# Altium schematic sheet Power.SchDoc
size B; DocumentNumber: 6; SheetNumber: 6; SheetTotal: 9; ENG_APP_DATE: --/--/--; DSN_APP_DATE: --/--/--; CHK_APP_DATE: --/--/--
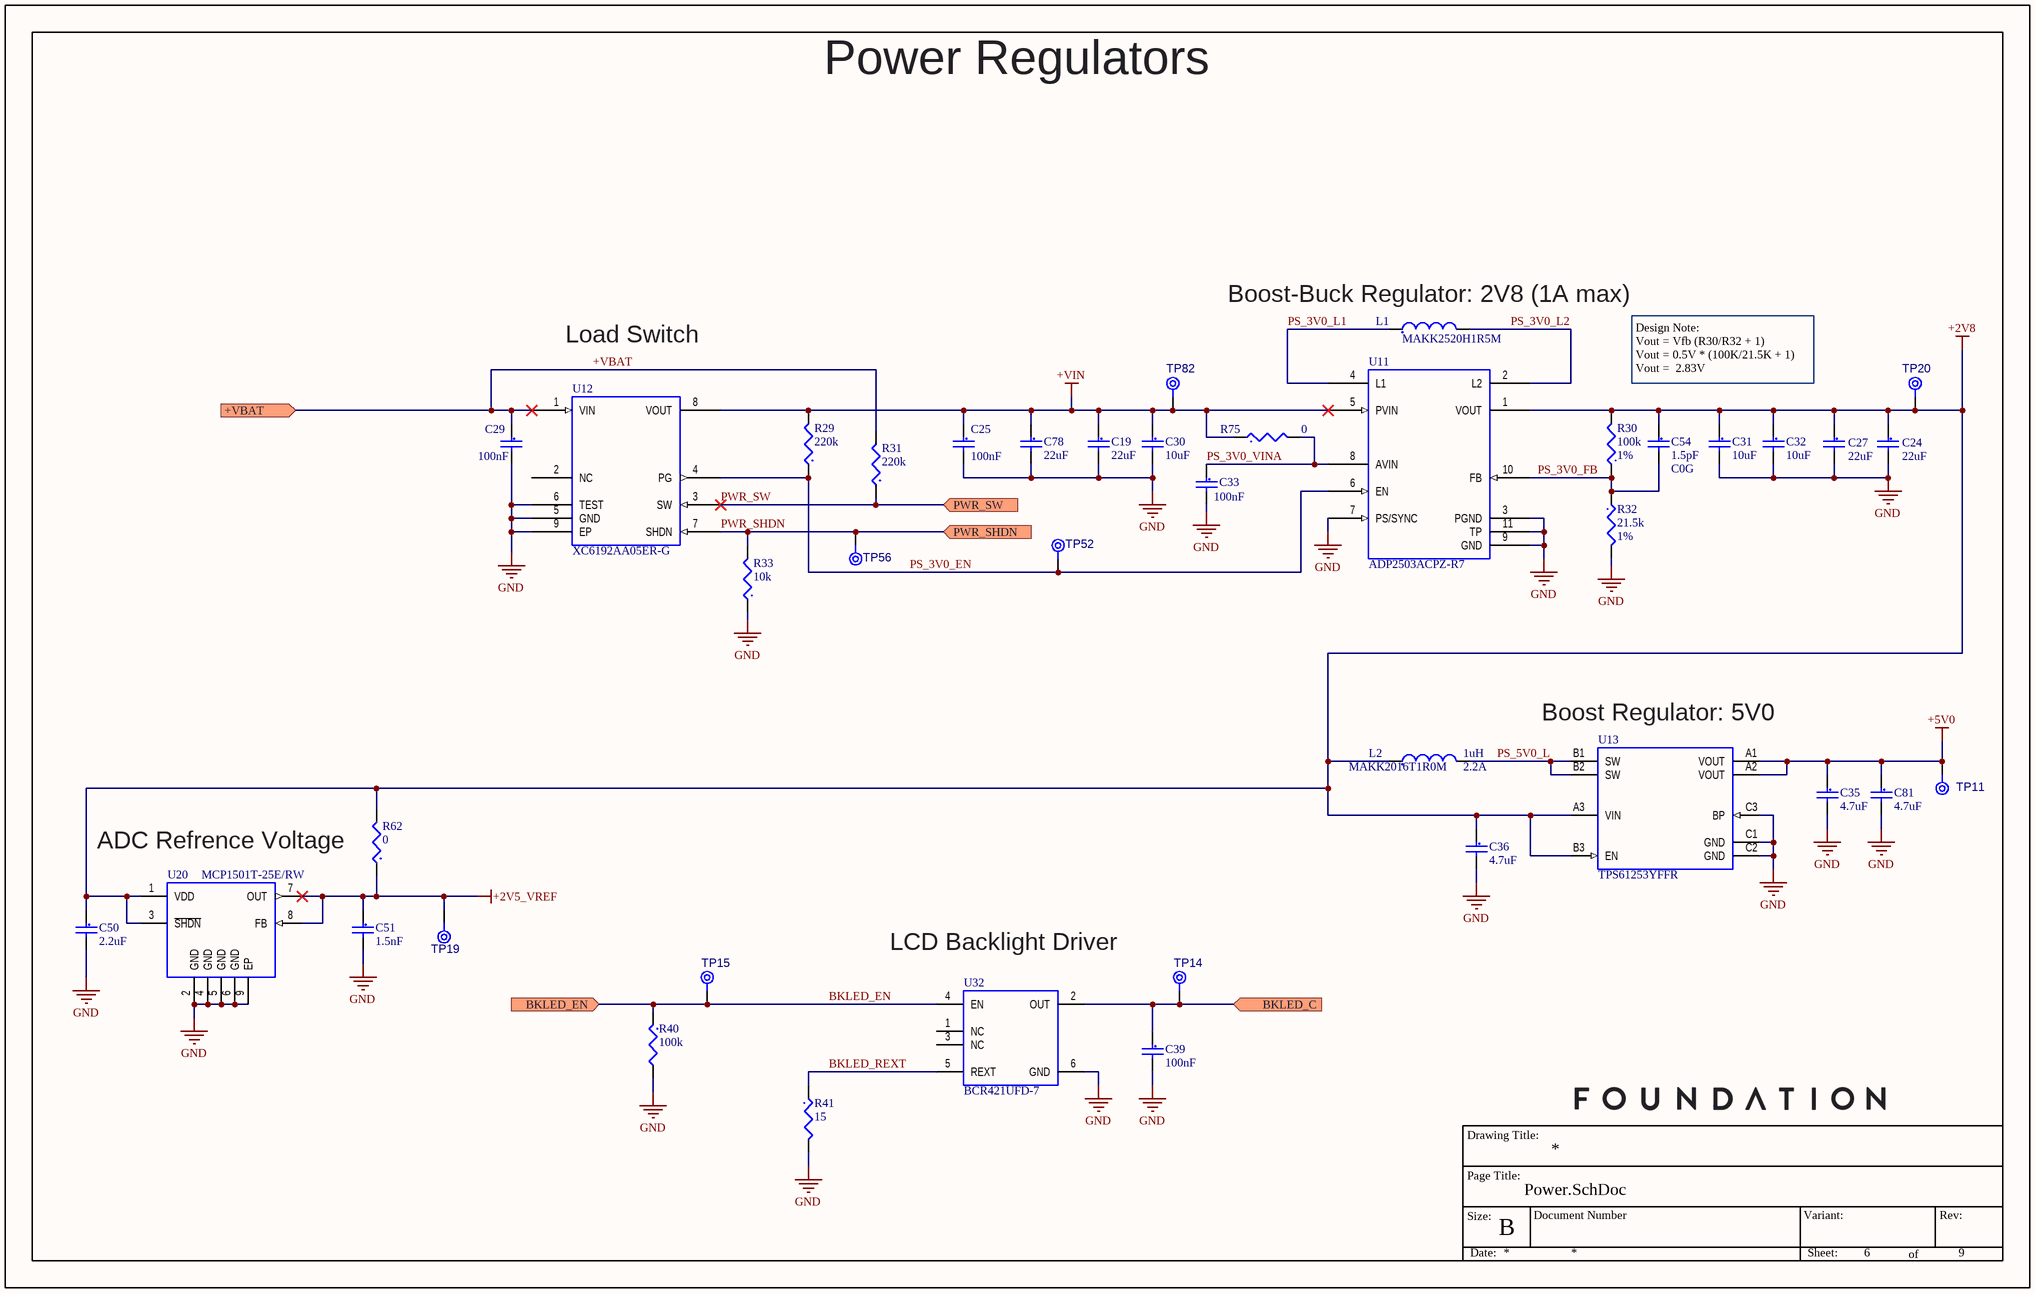
[diagram p0: Power.SchDoc]

## Parts
C19  Capacitance: 22uF  [CAPC0603(1608)90_L]  (hidden comment: CAP CER 22uF 6.3V 20% X5R 0603)
C24  Capacitance: 22uF  [CAPC0603(1608)90_L]  (hidden comment: CAP CER 22uF 6.3V 20% X5R 0603)
C25  Capacitance: 100nF  [CAPC0402(1005)55_L]  (hidden comment: CAP CER 0.1uF 16V 10% X7R 0402)
C27  Capacitance: 22uF  [CAPC0603(1608)90_L]  (hidden comment: CAP CER 22uF 6.3V 20% X5R 0603)
C29  Capacitance: 100nF  [CAPC0402(1005)55_L]  (hidden comment: CAP CER 0.1uF 16V 10% X7R 0402)
C30  Capacitance: 10uF  [CAPC0603(1608)90_L]  (hidden comment: CAP CER 10uF 6.3V 20% X5R 0603)
C31  Capacitance: 10uF  [CAPC0603(1608)90_L]  (hidden comment: CAP CER 10uF 6.3V 20% X5R 0603)
C32  Capacitance: 10uF  [CAPC0603(1608)90_L]  (hidden comment: CAP CER 10uF 6.3V 20% X5R 0603)
C33  Capacitance: 100nF  [CAPC0402(1005)55_L]  (hidden comment: CAP CER 0.1uF 16V 10% X7R 0402)
C35  Capacitance: 4.7uF  [CAPC0402(1005)55_L]  (hidden comment: CAP CER 4.7UF 10V 20% X5R 0402)
C36  Capacitance: 4.7uF  [CAPC0402(1005)55_L]  (hidden comment: CAP CER 4.7UF 10V 20% X5R 0402)
C39  Capacitance: 100nF  [CAPC0402(1005)55_L]  (hidden comment: CAP CER 0.1uF 16V 10% X7R 0402)
C50  Capacitance: 2.2uF  [CAPC0402(1005)55_L]  (hidden comment: CAP CER 2.2uF 6.3V 10% X5R 0402)
C51  Capacitance: 1.5nF  [CAPC0402(1005)55_L]  (hidden comment: CAP CER 1500pF 50V 10% X7R 0402)
C54  Capacitance: 1.5pF  Dielectric: C0G  [CAPC0402(1005)55_L]  (hidden comment: CAP CER 1.5pF 50V C0G 0402)
C78  Capacitance: 22uF  [CAPC0603(1608)90_L]  (hidden comment: CAP CER 22uF 6.3V 20% X5R 0603)
C81  Capacitance: 4.7uF  [CAPC0402(1005)55_L]  (hidden comment: CAP CER 4.7UF 10V 20% X5R 0402)
L1  MAKK2520H1R5M  [INDC1008(2520)100_V]
L2  MAKK2016T1R0M  Inductance-Nom (L): 1uH  Rated Current-Max: 2.2A  [INDC0806(2016)100_V]
R29  Resistance: 220k  [RESC0402(1005)_L]  (hidden comment: RES 220K 1/16W 1% 0402)
R30  Resistance: 100k  Tolerance: 1%  [RESC0402(1005)_L]  (hidden comment: RES 100K 1/16W 1% 0402)
R31  Resistance: 220k  [RESC0402(1005)_L]  (hidden comment: RES 220K 1/16W 1% 0402)
R32  Resistance: 21.5k  Tolerance: 1%  [RESC0402(1005)_L]  (hidden comment: RES 21.5K 1/16W 1% 0402)
R33  Resistance: 10k  [RESC0402(1005)_L]  (hidden comment: RES 10K 1/16W 1% 0402)
R40  Resistance: 100k  [RESC0402(1005)_L]  (hidden comment: RES 100K 1/16W 1% 0402)
R41  Resistance: 15  [RESC0402(1005)_L]  (hidden comment: RES 15 OHM 1% 1/16W 0402)
R62  Resistance: 0  [RESC0402(1005)_L]  (hidden comment: RES 0 OHM JUMPER 1/16W 0402)
R75  Resistance: 0  [RESC0402(1005)_L]  (hidden comment: RES 0 OHM JUMPER 1/16W 0402)
TP11  TPAD8R  [TP08R]  (value not drawn)  (no BOM)
TP14  TPAD8R  [TP08R]  (value not drawn)  (no BOM)
TP15  TPAD8R  [TP08R]  (value not drawn)  (no BOM)
TP19  TPAD8R  [TP08R]  (value not drawn)  (no BOM)
TP20  TPAD8R  [TP08R]  (value not drawn)  (no BOM)
TP52  TPAD8R  [TP08R]  (value not drawn)  (no BOM)
TP56  TPAD8R  [TP08R]  (value not drawn)  (no BOM)
TP82  TPAD8R  [TP08R]  (value not drawn)  (no BOM)
U11  ADP2503ACPZ-R7  [ADEV - LFCSP-10_V]
U12  XC6192AA05ER-G  [TORX - USP-8B06_V]
U13  TPS61253YFFR  [TI - DSBGA-YFF-9_V]
U20  MCP1501T-25E/RW  [MCHP - WDFN-8_L]
U32  BCR421UFD-7  [DIOD - U-DFN2020-6_L]

## Ports
+VBAT (in), BKLED_C (in), BKLED_EN (in), PWR_SHDN (in), PWR_SW (in)

## Nets
+2V5_VREF: C51.1 R62.1 TP19.1(TP) U20.7(OUT) U20.8(FB)
+2V8: C24.1 C27.1 C31.1 C32.1 C36.1 C50.1 C54.1 L2.1 R30.2 R62.2 TP20.1(TP) U11.1(VOUT) U13.A3(VIN) U13.B3(EN) U20.1(VDD) U20.3(~{SHDN})
+5V0: C35.1 C81.1 TP11.1(TP) U13.A1(VOUT) U13.A2(VOUT)
+VIN: C19.1 C25.1 C30.1 C78.1 R29.2 R75.1 TP82.1(TP) U11.5(PVIN) U12.8(VOUT)
GND: C19.2 C24.2 C25.2 C27.2 C29.2 C30.2 C31.2 C32.2 C33.2 C35.2 C36.2 C39.2 C50.2 C51.2 C78.2 C81.2 R32.2 R33.1 R40.2 R41.2 U11.3(PGND) U11.7(PS/SYNC) U11.9(GND) U11.11(TP) U12.5(GND) U12.6(TEST) U12.9(EP) U13.C1(GND) U13.C2(GND) U13.C3(BP) U20.2(GND) U20.4(GND) U20.5(GND) U20.6(GND) U20.9(EP) U32.6(GND)
+VBAT: C29.1 R31.2 U12.1(VIN) ; port +VBAT
BKLED_C: C39.1 TP14.1(TP) U32.2(OUT) ; port BKLED_C
BKLED_EN: R40.1 TP15.1(TP) U32.4(EN) ; port BKLED_EN
BKLED_REXT: R41.1 U32.5(REXT)
PS_3V0_EN: R29.1 TP52.1(TP) U11.6(EN) U12.4(PG)
PS_3V0_FB: C54.2 R30.1 R32.1 U11.10(FB)
PS_3V0_L1: L1.1 U11.4(L1)
PS_3V0_L2: L1.2 U11.2(L2)
PS_3V0_VINA: C33.1 R75.2 U11.8(AVIN)
PS_5V0_L: L2.2 U13.B1(SW) U13.B2(SW)
PWR_SHDN: R33.2 TP56.1(TP) U12.7(SHDN) ; port PWR_SHDN
PWR_SW: R31.1 U12.3(SW) ; port PWR_SW

Not connected (* = marked no-connect by the designer): U12 2(NC); U32 1(NC) 3(NC)

## Notes on the sheet
- Power Regulators
- Load Switch
- (near L1) Boost-Buck Regulator: 2V8 (1A max)
- Design Note:
  Vout = Vfb (R30/R32 + 1)
  Vout = 0.5V * (100K/21.5K + 1)
  Vout =  2.83V
- (near U13) Boost Regulator: 5V0
- ADC Refrence Voltage
- LCD Backlight Driver
- Drawing Title:
- Page Title:
- Size:
- B
- Document Number
- Variant:
- Rev:
- Date:
- Sheet:
- of

## Library data of the parts
C19 C24 C27 C78 = CMP-CAP-00029-2: 22µF ±20% 6.3V Ceramic Capacitor X5R 0603 (1608 Metric); Voltage: 6.3V; Dielectric Material: Ceramic; Packaging: Tape and Reel; Width: 0.031inch; Voltage Rating (DC): 6.3V; Mount: Surface Mount; Tolerance: 20%; Dielectric: X5R; Voltage Rating: 6.3V; Depth: 0.8mm; Termination: SMD/SMT; Min Operating Temperature: -55°C; Max Operating Temperature: 85°C; Length: 1.6mm; Case/Package: 0603; Height: 0.8mm; Thickness: 0.039inch; Lead Free: Lead Free; Case Code (Metric): 1608; REACH SVHC: No SVHC; Case Code (Imperial): 0603; Weight: 7.1E-05oz; Package Quantity: 1; Composition: Ceramic
C25 C29 C33 C39 = CMP-CAP-00002-2: 0.1µF ±10% 16V Ceramic Capacitor X7R 0402 (1005 Metric); Insulation Resistance: 10GR; Material: Ceramic; Tolerance: 10%; REACH SVHC: No SVHC; Radiation Hardening: No; Case Code (Metric): 1005; Height: 0.5mm; Depth: 0.5mm; Min Operating Temperature: -55°C; Max Operating Temperature: 125°C; Lead Free: Lead Free; Thickness: 0.022inch; Length: 1mm; Voltage Rating (DC): 16V; Dielectric Material: Ceramic; Packaging: Tape and Reel; Case/Package: 0402; Width: 0.5mm; Termination: SMD/SMT; Voltage Rating: 16V; Mount: Surface Mount; Case Code (Imperial): 0402; Package Quantity: 1; Dielectric: X7R; Number of Pins: 2; Voltage: 16V
C30-C32 = CMP-CAP-00044-1: 10µF ±20% 6.3V Ceramic Capacitor X5R 0603 (1608 Metric); Max Operating Temperature: 85°C; Packaging: Tape and Reel; Case Code (Metric): 1608; Radiation Hardening: No; REACH SVHC: No SVHC; Min Operating Temperature: -55°C; Tolerance: 20%; Lead Free: Lead Free; Thickness: 0.035inch; Voltage Rating (DC): 6.3V; Material: Ceramic; Width: 0.031inch; Length: 1.6mm; Voltage: 6.3V; Mount: Surface Mount; Voltage Rating: 6.3V; Termination: SMD/SMT; Depth: 0.8mm; Dielectric: X5R; Case/Package: 0603; Package Quantity: 4000; Case Code (Imperial): 0603; Height: 0.8mm
C35 C36 C81 = CMP-CAP-00038-1: 4.7µF ±20% 10V Ceramic Capacitor X5R 0402 (1005 Metric); Max Operating Temperature: 85°C; Packaging: Tape and Reel; Case Code (Metric): 1005; Radiation Hardening: No; REACH SVHC: No SVHC; Min Operating Temperature: -55°C; Tolerance: 20%; Lead Free: Lead Free; Thickness: 500um; Voltage Rating (DC): 10V; Width: 0.02inch; Length: 1mm; Voltage: 10V; Mount: Surface Mount; Voltage Rating: 10V; Termination: SMD/SMT; Depth: 0.5mm; Dielectric: X5R; Case/Package: 0402; Package Quantity: 1; Case Code (Imperial): 0402; Height: 0.5mm; Weight: 2.3E-05oz; Composition: Ceramic; Dielectric Material: Ceramic
C50 = CMP-CAP-00042-1: 2.2µF ±10% 6.3V Ceramic Capacitor X5R 0402 (1005 Metric); Lead Free: Lead Free; Tolerance: 10%; Width: 0.02inch; Number of Pins: 2; Contact Plating: Tin,Matte; Max Operating Temperature: 85°C; Termination: SMD/SMT; Voltage Rating: 6.3V; Thickness: 0.022inch; Case Code (Imperial): 0402; Case Code (Metric): 1005; Radiation Hardening: No; Package Quantity: 1; Mount: Surface Mount; Length: 1mm; Case/Package: 0402; REACH SVHC: No SVHC; Packaging: Tape and Reel; Min Operating Temperature: -55°C; Dielectric: X5R; Depth: 0.5mm; Voltage Rating (DC): 6.3V
C51 = CMP-CAP-00034-1: 1500pF ±10% 50V Ceramic Capacitor X7R 0402 (1005 Metric); Case/Package: 0402; Thickness: 0.022inch; Max Operating Temperature: 125°C; Package Quantity: 1; Contact Plating: Tin; Dielectric: X7R; Min Operating Temperature: -55°C; Voltage: 50V; Case Code (Metric): 1005; Length: 1mm; Packaging: Tape and Reel; Width: 0.02inch; Depth: 0.5mm; Voltage Rating: 50V; Material: Ceramic; Tolerance: 10%; Case Code (Imperial): 0402; Radiation Hardening: No; Height: 0.5mm; Mount: Surface Mount
C54 = CMP-CAP-00048-1: 1.5pF ±0.25pF 50V Ceramic Capacitor C0G, NP0 0402 (1005 Metric); Tolerance: 20%; Mount: Surface Mount; Min Operating Temperature: -55°C; Lead Free: Lead Free; Termination: SMD/SMT; Width: 0.02inch; Voltage: 50V; Height: 0.5mm; Package Quantity: 1; Voltage Rating (DC): 50V; Packaging: Tape and Reel; Max Operating Temperature: 125°C; Case Code (Imperial): 0402; Voltage Rating: 50V; Case/Package: 0402; Case Code (Metric): 1005; Thickness: 0.022inch; Length: 1mm; Radiation Hardening: No; Depth: 0.5mm
L1 = CMP-IND-0022-1: 1.5 µH Shielded Wirewound Inductor 2.4 A 78mOhm Max 1008 (2520 Metric); Inductor Type: GENERAL PURPOSE INDUCTOR; RoHS Compliant: Yes; REACH SVHC: No SVHC
L2 = CMP-IND-0023-1: 1 µH Shielded Wirewound Inductor 2.2 A 75mOhm Max 0806 (2016 Metric); Tolerance: 20%; Core Material: Metal; Inductor Type: GENERAL PURPOSE INDUCTOR; DC Resistance (DCR): 75mR; Package Width: 1.6mm; Package Height: 1mm; Package Length: 2mm; Case/Size Code: 0806; Max Operating Temperature: 105°C; RoHS Compliant: Yes; REACH SVHC: Yes; Min Operating Temperature: -40°C; Construction: Wirewound Chip; Packaging: Tape and Reel; Package Style: SMTMeter
R29 R31 = CMP-RES-00039-1: 220 kOhms ±1% 0.063W, 1/16W Chip Resistor 0402 (1005 Metric); Temperature Coefficient: 100ppm/°C; Max Power Dissipation: 63mW; Voltage Rating (DC): 50V; Min Operating Temperature: -55°C; Depth: 0.5mm; Height: 0.35mm; Length: 1mm; Number of Terminations: 2; Termination: SMD/SMT; Composition: Thick Film; Military Standard: Not; Case Code (Metric): 1005; Case Code (Imperial): 0402; REACH SVHC: Unknown; Features: Automotive AEC-Q200; Packaging: Tape and Reel; Width: 0.5mm; Lead Free: Lead Free; Package Quantity: 10; Voltage Rating: 50V; Case/Package: 0402; Tolerance: 1%; Max Operating Temperature: 155°C; Power Rating: 63mW; Contact Plating: Tin; Weight: 2.3E-05oz; Mount: Surface Mount; Radiation Hardening: No
R30 = CMP-RES-00003-3: 100 kOhms ±1% 0.063W, 1/16W Chip Resistor 0402 (1005 Metric) Automotive AEC-Q200 Thick Film; Temperature Coefficient: 100ppm/°C; Max Power Dissipation: 63mW; Voltage Rating: 50V; Width: 0.02inch; Number of Terminations: 2; Composition: Thick Film; Radiation Hardening: No; Case Code (Imperial): 0402; Depth: 0.5mm; Packaging: Tape and Reel; Length: 1mm; Min Operating Temperature: -55°C; Contact Plating: Tin; Features: Automotive AEC-Q200; Max Operating Temperature: 155°C; Power Rating: 63mW; Mount: Surface Mount; Case Code (Metric): 1005; Case/Package: 0402; Height: 0.35mm; Lead Free: Lead Free; Military Standard: Not; Termination: SMD/SMT; Package Quantity: 10000; Voltage Rating (DC): 50V; REACH SVHC: Unknown; Number of Pins: 2; Weight: 2.3E-05oz
R32 = CMP-RES-00073-1: 21.5 kOhms ±1% 0.063W, 1/16W Chip Resistor 0402 (1005 Metric); Reference Standard: AEC-Q200; Package Height: 0.35mm; Rated Power Dissipation (P): 63mW; Rated Temperature: 70°C; Package Width: 0.5mm; Voltage Rating: 50V; Temperature Coefficient: 100ppm/°C; Number of Terminals/Pins: 2; Package Length: 1mm; Mount: Surface Mount; Resistor Type: FIXED RESISTOR; Max Operating Temperature: 155°C; JESD-609 Code: e3; Package Shape: Rectangular; Terminal Finish: Nickel; Packaging: Tape and Reel; Size Code: 0402; Package Style: SMTMeter; Technology: METAL GLAZE/THICK FILM; Termination: Wraparound; Working Voltage: 50V; Construction: Chip; Min Operating Temperature: -55°C
R33 = CMP-RES-00006-3: 10 kOhms ±1% 0.063W, 1/16W Chip Resistor 0402 (1005 Metric); Max Power Dissipation: 63mW; Voltage Rating: 50V; Temperature Coefficient: 100ppm/°C; Military Standard: Not; Lead Free: Lead Free; Max Operating Temperature: 155°C; Termination: SMD/SMT; REACH SVHC: Unknown; Packaging: Tape and Reel; Composition: Thick Film; Weight: 2.3E-05oz; Mount: Surface Mount; Height: 0.35mm; Length: 1mm; Min Operating Temperature: -55°C; Radiation Hardening: No; Voltage Rating (DC): 50V; Number of Terminations: 2; Features: Automotive AEC-Q200; Package Quantity: 10; Depth: 0.5mm; Case/Package: 0402; Case Code (Metric): 1005; Case Code (Imperial): 0402; Tolerance: 1%; Power Rating: 63mW; Width: 0.02inch; Contact Plating: Tin; Number of Pins: 2
R40 = CMP-RES-00003-3: 100 kOhms ±1% 0.063W, 1/16W Chip Resistor 0402 (1005 Metric) Automotive AEC-Q200 Thick Film; Max Power Dissipation: 63mW; Voltage Rating: 50V; Temperature Coefficient: 100ppm/°C; Max Operating Temperature: 155°C; Weight: 2.3E-05oz; Packaging: Tape and Reel; REACH SVHC: Unknown; Length: 1mm; Features: Automotive AEC-Q200; Depth: 0.5mm; Composition: Thick Film; Case Code (Imperial): 0402; Number of Terminations: 2; Package Quantity: 10000; Min Operating Temperature: -55°C; Number of Pins: 2; Lead Free: Lead Free; Military Standard: Not; Case/Package: 0402; Contact Plating: Tin; Tolerance: 1%; Radiation Hardening: No; Termination: SMD/SMT; Voltage Rating (DC): 50V; Mount: Surface Mount; Power Rating: 63mW; Case Code (Metric): 1005; Width: 0.02inch; Height: 0.35mm
R41 = CMP-RES-00085-1: 15 Ohms ±1% 0.063W, 1/16W Chip Resistor 0402 (1005 Metric); Power: 63mW; Voltage Rating: 50V; Number of Terminals/Pins: 2; Case/Package: 0402; Tolerance: 1%; RoHS Compliant: Yes; REACH SVHC: Yes; Resistor Type: FIXED RESISTOR
R62 = CMP-RES-00014-4: 0 Ohms Jumper 0.063W, 1/16W Chip Resistor 0402 (1005 Metric); Temperature Coefficient: 200ppm/°C; Power Rating: 62.5mW; Max Power Dissipation: 63mW; Tolerance: 5%; Voltage Rating: 50V; Lead Free: Lead Free; Height: 0.016inch; Military Standard: Not; Max Operating Temperature: 155°C; Features: Moisture Resistant; Case/Package: 0402; Contact Plating: Tin,Matte; Composition: Thick Film; Number of Terminations: 2; Case Code (Imperial): 0402; Package Quantity: 1; REACH SVHC: Unknown; Radiation Hardening: No; Case Code (Metric): 1005; Width: 0.02inch; Termination: SMD/SMT; Min Operating Temperature: -55°C; Length: 1mm; Packaging: Tape and Reel; Depth: 0.5mm
R75 = CMP-RES-00014-4: 0 Ohms Jumper 0.063W, 1/16W Chip Resistor 0402 (1005 Metric); Power Rating: 62.5mW; Temperature Coefficient: 200ppm/°C; Tolerance: 5%; Voltage Rating: 50V; Max Power Dissipation: 63mW; Depth: 0.5mm; Military Standard: Not; Width: 0.02inch; Max Operating Temperature: 155°C; Composition: Thick Film; Min Operating Temperature: -55°C; Case Code (Imperial): 0402; Case Code (Metric): 1005; Packaging: Tape and Reel; Height: 0.016inch; Radiation Hardening: No; Lead Free: Lead Free; Case/Package: 0402; Package Quantity: 1; Contact Plating: Tin,Matte; Termination: SMD/SMT; Length: 1mm; REACH SVHC: Unknown; Features: Moisture Resistant; Number of Terminations: 2
TP11 TP14 TP15 TP19 TP20 TP52 TP56 TP82 = CMP-MECH-00011-2: 0.8mm round; Pins: 1
U11 = CMP-PMIC-00057-3: Buck-Boost Switching Regulator IC Positive Adjustable 2.8V 1 Output 600mA 10-VFDFN Exposed Pad, CSP; Max Output Current: 1.4A; Min Input Voltage: 2.3V; Max Input Voltage: 5.5V; Switching Frequency-Max: 2.9MHz; Control Technique: PULSE WIDTH MODULATION; Control Mode: CURRENT-MODE; Time @ Peak Reflow Temperature-Max (s): 40s; Number of Terminals/Pins: 10; Package Equivalence Code: SOLCC10,.12,20; Nominal Input Voltage: 3.6V; Qualification Status: Not Qualified; Number of Functions: 1; Package Body Material: Plastic; ComponentLink1Description: Datasheet; ComponentLink1URL: https://www.analog.com/media/en/technical-documentation/data-sheets/ADP2503_2504.pdf; Max Operating Temperature: 85°C; Min Operating Temperature: -40°C; REACH SVHC: Yes; RoHS Compliant: Yes; JESD-609 Code: e3; Package Shape: Square; Terminal Form: No Lead; Package Code: HVSON; Height - Seated (Max): 0.85mm; Length: 3mm; Moisture Sensitivity Level: 3; Switcher Configuration: BUCK-BOOST; Surface Mount: Yes; Width: 3mm; Package Style: SMALL OUTLINE, HEAT SINK/SLUG, VERY THIN PROFILEMeter; Temperature Grade: INDUSTRIAL; Terminal Position: DUAL; Analog IC - Other Type: SWITCHING REGULATOR; Terminal Pitch: 0.5mm; Terminal Finish: Tin; Peak Reflow Temperature (Cel): 260°C; JESD-30 Code: S-PDSO-N10
U12 = CMP-PMIC-00012-5: Power Switch/Driver 1:1 P-Channel 400mA USP-8B06; Fault Protection: Short Circuit; Interface: On/Off; Number of Outputs: 1; Output Configuration: High Side; ComponentLink1Description: Datasheet; Packaging: Tape and Reel; Max Output Current: 400mA; Max Operating Temperature: 85°C; ComponentLink1URL: https://www.torexsemi.com/file/xc6192/XC6192.pdf; Min Operating Temperature: -40°C
U13 = CMP-PMIC-00053-2: Boost Switching Regulator IC Positive Fixed 5V 1 Output 3.9A (Switch) 9-UFBGA, DSBGA; Min Input Voltage: 2.65V; Number of Functions: 1; Max Input Voltage: 4.85V; Package Body Material: Plastic; Nominal Input Voltage: 3.6V; Qualification Status: Not Qualified; Control Technique: PULSE WIDTH MODULATION; Switching Frequency-Max: 3.5MHz; Number of Terminals/Pins: 9; Control Mode: CURRENT-MODE; JESD-609 Code: e1; Nominal Output Voltage: 5V; Moisture Sensitivity Level: 1; Switcher Configuration: BOOST; REACH SVHC: Yes; Peak Reflow Temperature (Cel): 260°C; Analog IC - Other Type: SWITCHING REGULATOR; ComponentLink1Description: Datasheet; Height - Seated (Max): 0.625mm; Surface Mount: Yes; Terminal Position: BOTTOM; Length: 1.6mm; ComponentLink1URL: https://www.ti.com/lit/ds/symlink/tps61253.pdf?HQS=dis-dk-null-digikeymode-dsf-pf-null-wwe&ts=1624381388723&ref_url=https%253A%252F%252Fwww.ti.com%252Fgeneral%252Fdocs%252Fsuppproductinfo.tsp%253FdistId%253D10%2526gotoUrl%253Dhttps%253A%252F%252Fwww.ti.com%252Flit%252Fgpn%252Ftps61253; Terminal Pitch: 0.4mm; Package Style: GRID ARRAY, VERY THIN PROFILE, FINE PITCHMeter; Terminal Form: Ball; Terminal Finish: Copper; Temperature Grade: INDUSTRIAL; RoHS Compliant: Yes; Package Code: VFBGA; Width: 1.6mm; Package Shape: Square; Max Operating Temperature: 85°C; Min Operating Temperature: -40°C
U20 = CMP-PMIC-00034-1: Series Voltage Reference IC 2.5V ±0.1%  8-WDFN (2x2); Supply Voltage-Max (Vsup): 5.5V; Trim/Adjustable Output: No; Min Output Voltage: 2.4975V; Package Body Material: Plastic; Time @ Peak Reflow Temperature-Max (s): 30s; Temp Coef of Voltage-Max: 50ppm/°C; Max Output Voltage: 2.5025V; Supply Voltage-Min (Vsup): 2.7V; Number of Terminals/Pins: 8; Number of Functions: 1; Analog IC - Other Type: THREE TERMINAL VOLTAGE REFERENCE; ComponentLink1URL: https://ww1.microchip.com/downloads/en/DeviceDoc/20005474E.pdf; Min Operating Temperature: -40°C; ComponentLink1Description: Datasheet; Max Operating Temperature: 125°C; Package Code: HVSON; Terminal Finish: Tin; Height - Seated (Max): 0.8mm; Surface Mount: Yes; Width: 2mm; Package Style: SMALL OUTLINE, HEAT SINK/SLUG, VERY THIN PROFILEMeter; Nominal Output Voltage: 2.5V; JESD-30 Code: S-PDSO-N8; JESD-609 Code: e3; Length: 2mm; Terminal Position: DUAL; Terminal Pitch: 0.5mm; Peak Reflow Temperature (Cel): 260°C; Package Shape: Square; Temperature Grade: AUTOMOTIVE; Terminal Form: No Lead; Number of Outputs: 1
U32 = CMP-PMIC-00061-1: LED Driver IC 1 Output Linear - PWM Dimming 350mA U-DFN2020-6; Time @ Peak Reflow Temperature-Max (s): 30s; Interface IC Type: LED DISPLAY DRIVER; ComponentLink1URL: https://www.diodes.com/assets/Datasheets/BCR420UFD-BCR421UFD.pdf; REACH SVHC: Yes; JESD-609 Code: e3; RoHS Compliant: Yes; Terminal Finish: Tin; Peak Reflow Temperature (Cel): 260°C; ComponentLink1Description: Datasheet